# EAGLE design bga_test (EAGLE 6.4)

## Sheet 1 of 2
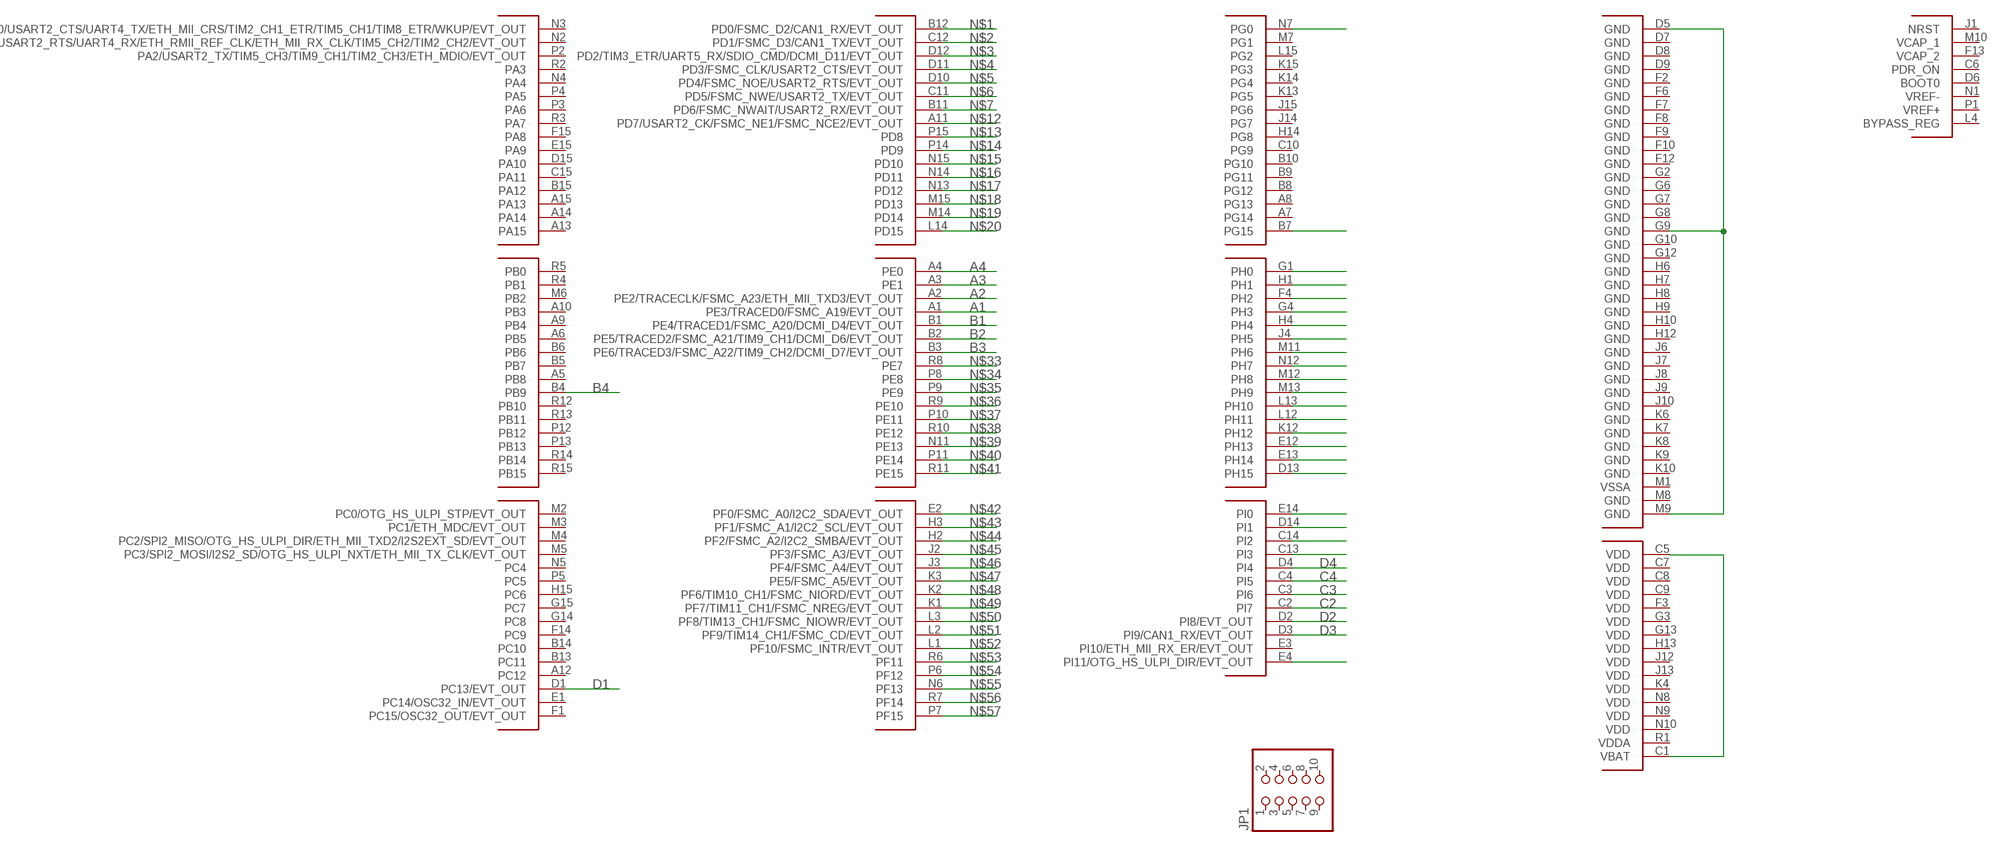
[diagram p0: schematic, sheet 1]

### Parts
JP1  PINHD-2X5  [2X05]
U$1  STM32_32BIT_MCU_STM32F407IG  [STM32_32BIT_MCU_UFBGA176+25]

### Nets
A1: U$1.A1(PE3/TRACED0/FSMC_A19/EVT_OUT) ; also sheet 2
A2: U$1.A2(PE2/TRACECLK/FSMC_A23/ETH_MII_TXD3/EVT_OUT) ; also sheet 2
A3: U$1.A3(PE1) ; also sheet 2
A4: U$1.A4(PE0) ; also sheet 2
B1: U$1.B1(PE4/TRACED1/FSMC_A20/DCMI_D4/EVT_OUT) ; also sheet 2
B2: U$1.B2(PE5/TRACED2/FSMC_A21/TIM9_CH1/DCMI_D6/EVT_OUT) ; also sheet 2
B3: U$1.B3(PE6/TRACED3/FSMC_A22/TIM9_CH2/DCMI_D7/EVT_OUT) ; also sheet 2
B4: U$1.B4(PB9) ; also sheet 2
C2: U$1.C2(PI7) ; also sheet 2
C3: U$1.C3(PI6) ; also sheet 2
C4: U$1.C4(PI5) ; also sheet 2
D1: U$1.D1(PC13/EVT_OUT)
D2: U$1.D2(PI8/EVT_OUT) ; also sheet 2
D3: U$1.D3(PI9/CAN1_RX/EVT_OUT) ; also sheet 2
D4: U$1.D4(PI4) ; also sheet 2
N$1: U$1.B12(PD0/FSMC_D2/CAN1_RX/EVT_OUT)
N$2: U$1.C12(PD1/FSMC_D3/CAN1_TX/EVT_OUT)
N$3: U$1.D12(PD2/TIM3_ETR/UART5_RX/SDIO_CMD/DCMI_D11/EVT_OUT)
N$4: U$1.D11(PD3/FSMC_CLK/USART2_CTS/EVT_OUT)
N$5: U$1.D10(PD4/FSMC_NOE/USART2_RTS/EVT_OUT)
N$6: U$1.C11(PD5/FSMC_NWE/USART2_TX/EVT_OUT)
N$7: U$1.B11(PD6/FSMC_NWAIT/USART2_RX/EVT_OUT)
N$12: U$1.A11(PD7/USART2_CK/FSMC_NE1/FSMC_NCE2/EVT_OUT)
N$13: U$1.P15(PD8)
N$14: U$1.P14(PD9)
N$15: U$1.N15(PD10)
N$16: U$1.N14(PD11)
N$17: U$1.N13(PD12)
N$18: U$1.M15(PD13)
N$19: U$1.M14(PD14)
N$20: U$1.L14(PD15)
N$33: U$1.R8(PE7)
N$34: U$1.P8(PE8)
N$35: U$1.P9(PE9)
N$36: U$1.R9(PE10)
N$37: U$1.P10(PE11)
N$38: U$1.R10(PE12)
N$39: U$1.N11(PE13)
N$40: U$1.P11(PE14)
N$41: U$1.R11(PE15)
N$42: U$1.E2(PF0/FSMC_A0/I2C2_SDA/EVT_OUT)
N$43: U$1.H3(PF1/FSMC_A1/I2C2_SCL/EVT_OUT)
N$44: U$1.H2(PF2/FSMC_A2/I2C2_SMBA/EVT_OUT)
N$45: U$1.J2(PF3/FSMC_A3/EVT_OUT)
N$46: U$1.J3(PF4/FSMC_A4/EVT_OUT)
N$47: U$1.K3(PE5/FSMC_A5/EVT_OUT)
N$48: U$1.K2(PF6/TIM10_CH1/FSMC_NIORD/EVT_OUT)
N$49: U$1.K1(PF7/TIM11_CH1/FSMC_NREG/EVT_OUT)
N$50: U$1.L3(PF8/TIM13_CH1/FSMC_NIOWR/EVT_OUT)
N$51: U$1.L2(PF9/TIM14_CH1/FSMC_CD/EVT_OUT)
N$52: U$1.L1(PF10/FSMC_INTR/EVT_OUT)
N$53: U$1.R6(PF11)
N$54: U$1.P6(PF12)
N$55: U$1.N6(PF13)
N$56: U$1.R7(PF14)
N$57: U$1.P7(PF15)
N$59: U$1.G1(PH0)
N$60: U$1.N7(PG0)
N$61: U$1.D5(GND) U$1.G9(GND) U$1.M9(GND)
N$64: U$1.C1(VBAT) U$1.C5(VDD)
N$65: U$1.D13(PH15)
N$66: U$1.M12(PH8)
N$67: U$1.B7(PG15)
N$68: U$1.E4(PI11/OTG_HS_ULPI_DIR/EVT_OUT)
N$69: U$1.E14(PI0)
N$70: U$1.D14(PI1)
N$71: U$1.C14(PI2)
N$72: U$1.C13(PI3)
N$76: U$1.E13(PH14)
N$77: U$1.E12(PH13)
N$78: U$1.K12(PH12)
N$79: U$1.L12(PH11)
N$80: U$1.L13(PH10)
N$81: U$1.M13(PH9)
N$82: U$1.N12(PH7)
N$83: U$1.M11(PH6)
N$84: U$1.J4(PH5)
N$85: U$1.H4
N$86: U$1.G4(PH3)
N$87: U$1.F4(PH2)
N$88: U$1.H1
Unconnected: JP1.1 JP1.2 JP1.3 JP1.4 JP1.5 JP1.6 JP1.7 JP1.8 JP1.9 JP1.10 U$1.A5(PB8) U$1.A6(PB5) U$1.A7(PG14) U$1.A8(PG13) U$1.A9(PB4) U$1.A10(PB3) U$1.A12(PC12) U$1.A13(PA15) U$1.A14 U$1.A15(PA13) U$1.B5(PB7) U$1.B6 U$1.B8(PG12) U$1.B9(PG11) U$1.B10(PG10) U$1.B13(PC11) U$1.B14(PC10) U$1.B15(PA12) U$1.C6(PDR_ON) U$1.C7(VDD) U$1.C8(VDD) U$1.C9(VDD) U$1.C10(PG9) U$1.C15(PA11) U$1.D6(BOOT0) U$1.D7(GND) U$1.D8(GND) U$1.D9(GND) U$1.D15(PA10) U$1.E1(PC14/OSC32_IN/EVT_OUT) U$1.E3(PI10/ETH_MII_RX_ER/EVT_OUT) U$1.E15(PA9) U$1.F1(PC15/OSC32_OUT/EVT_OUT) U$1.F2(GND) U$1.F3(VDD) U$1.F6(GND) U$1.F7(GND) U$1.F8(GND) U$1.F9(GND) U$1.F10(GND) U$1.F12(GND) U$1.F13(VCAP_2) U$1.F14(PC9) U$1.F15(PA8) U$1.G2(GND) U$1.G3(VDD) U$1.G6(GND) U$1.G7(GND) U$1.G8(GND) U$1.G10(GND) U$1.G12(GND) U$1.G13(VDD) U$1.G14(PC8) U$1.G15(PC7) U$1.H6(GND) U$1.H7(GND) U$1.H8(GND) U$1.H9(GND) U$1.H10(GND) U$1.H12(GND) U$1.H13(VDD) U$1.H14(PG8) U$1.H15(PC6) U$1.J1(NRST) U$1.J6(GND) U$1.J7(GND) U$1.J8(GND) U$1.J9(GND) U$1.J10(GND) U$1.J12(VDD) U$1.J13(VDD) U$1.J14(PG7) U$1.J15(PG6) U$1.K4(VDD) U$1.K6(GND) U$1.K7(GND) U$1.K8(GND) U$1.K9(GND) U$1.K10(GND) U$1.K13(PG5) U$1.K14(PG4) U$1.K15(PG3) U$1.L4(BYPASS_REG) U$1.L15(PG2) U$1.M1(VSSA) U$1.M2(PC0/OTG_HS_ULPI_STP/EVT_OUT) U$1.M3(PC1/ETH_MDC/EVT_OUT) U$1.M4(PC2/SPI2_MISO/OTG_HS_ULPI_DIR/ETH_MII_TXD2/I2S2EXT_SD/EVT_OUT) U$1.M5(PC3/SPI2_MOSI/I2S2_SD/OTG_HS_ULPI_NXT/ETH_MII_TX_CLK/EVT_OUT) U$1.M6(PB2) U$1.M7(PG1) U$1.M8(GND) U$1.M10(VCAP_1) U$1.N1(VREF-) U$1.N2(PA1/USART2_RTS/UART4_RX/ETH_RMII_REF_CLK/ETH_MII_RX_CLK/TIM5_CH2/TIM2_CH2/EVT_OUT) U$1.N3(PA0/USART2_CTS/UART4_TX/ETH_MII_CRS/TIM2_CH1_ETR/TIM5_CH1/TIM8_ETR/WKUP/EVT_OUT) U$1.N4(PA4) U$1.N5(PC4) U$1.N8(VDD) U$1.N9(VDD) U$1.N10(VDD) U$1.P1(VREF+) U$1.P2(PA2/USART2_TX/TIM5_CH3/TIM9_CH1/TIM2_CH3/ETH_MDIO/EVT_OUT) U$1.P3(PA6) U$1.P4(PA5) U$1.P5(PC5) U$1.P12(PB12) U$1.P13(PB13) U$1.R1(VDDA) U$1.R2(PA3) U$1.R3(PA7) U$1.R4(PB1) U$1.R5(PB0) U$1.R12(PB10) U$1.R13(PB11) U$1.R14(PB14) U$1.R15(PB15)

## Sheet 2 of 2
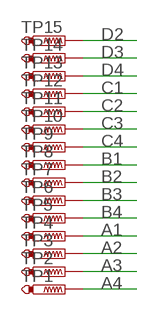
[diagram p1: schematic, sheet 2]

### Parts
TP1  PTR1TP06R  [TP06R]
TP2  PTR1TP06R  [TP06R]
TP3  PTR1TP06R  [TP06R]
TP4  PTR1TP06R  [TP06R]
TP5  PTR1TP06R  [TP06R]
TP6  PTR1TP06R  [TP06R]
TP7  PTR1TP06R  [TP06R]
TP8  PTR1TP06R  [TP06R]
TP9  PTR1TP06R  [TP06R]
TP10  PTR1TP06R  [TP06R]
TP11  PTR1TP06R  [TP06R]
TP12  PTR1TP06R  [TP06R]
TP13  PTR1TP06R  [TP06R]
TP14  PTR1TP06R  [TP06R]
TP15  PTR1TP06R  [TP06R]

### Nets
A1: TP4.TP ; also sheet 1
A2: TP3.TP ; also sheet 1
A3: TP2.TP ; also sheet 1
A4: TP1.TP ; also sheet 1
B1: TP8.TP ; also sheet 1
B2: TP7.TP ; also sheet 1
B3: TP6.TP ; also sheet 1
B4: TP5.TP ; also sheet 1
C1: TP12.TP
C2: TP11.TP ; also sheet 1
C3: TP10.TP ; also sheet 1
C4: TP9.TP ; also sheet 1
D2: TP15.TP ; also sheet 1
D3: TP14.TP ; also sheet 1
D4: TP13.TP ; also sheet 1

## Library data of the parts
JP1 = pinhead:PINHD-2X5: PIN HEADER
TP1-TP15 = testpad:PTR1: TEST PIN
U$1 = logic:STM32_32BIT_MCU_STM32F407IG

## Board
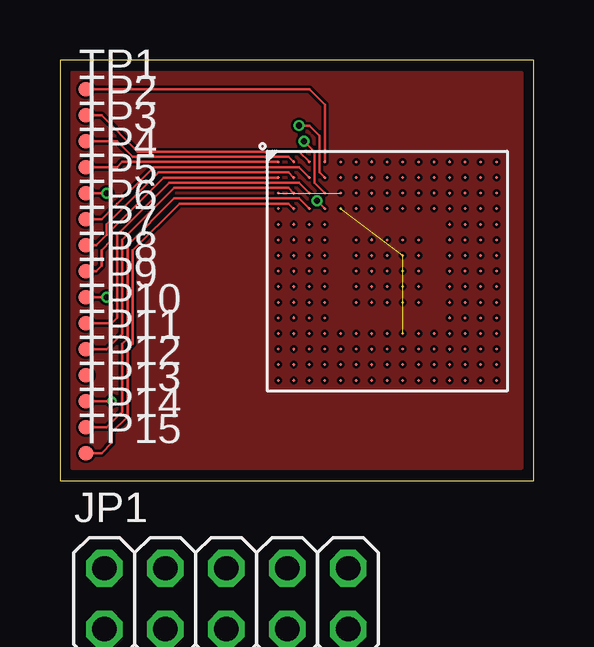
[diagram p2: board, top side]
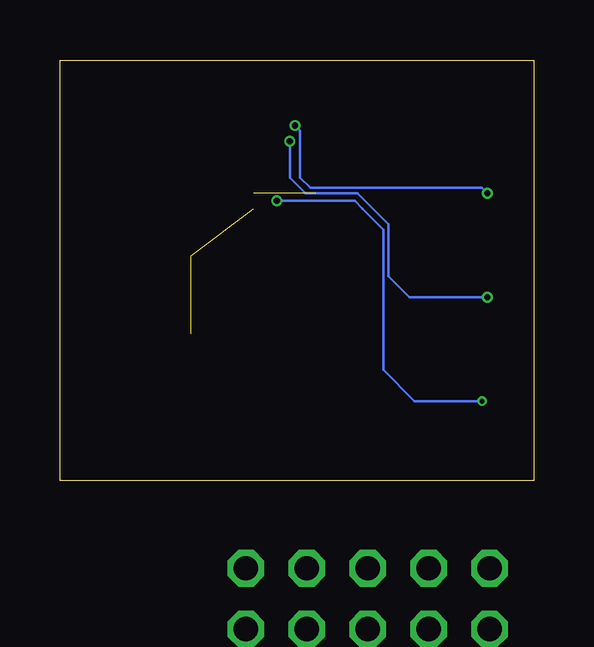
[diagram p3: board, bottom side, seen from below]

Size 19.77 x 17.53 mm. Coordinates in mm from the lower left corner, seen from the top.
Outline: 0,0 19.77,0 19.77,17.53 0,17.53 0,0
Copper layers (1*2*3*16): Top 0.035mm / dielectric 1.5mm / Route2 0.035mm / dielectric 0.15mm / Route3 0.035mm / dielectric 0.2mm / Bottom 0.035mm
Design rules "default *": minimum track width 4mil, minimum drill 10mil, track to track 4mil, track to pad 4mil, pad to pad 4mil, via to via 4mil, smd to smd 4mil, copper to edge 16mil, drill to drill 4mil, minimum pad ring 4mil, minimum via ring 4mil, stop-mask expansion 4mil, vias tented up to drill 16mil, thermal gap 10mil

### Footprints (pad centres in the part's own frame; a part is rotated, then mirrored left to right if it is on the bottom)
2X05 = drill 1.016 octagon: 1 -5.08,-1.27; 2 -5.08,1.27; 3 -2.54,-1.27; 4 -2.54,1.27; 5 0,-1.27; 6 0,1.27; 7 2.54,-1.27; 8 2.54,1.27; 9 5.08,-1.27; 10 5.08,1.27
TP06R = smd 0.6 x 0.6: TP 0,0
STM32_32BIT_MCU_UFBGA176+25 = smd 0.13 x 0.13: A1 -4.55,4.55; A2 -3.9,4.55; A3 -3.25,4.55; A4 -2.6,4.55; A5 -1.95,4.55; A6 -1.3,4.55; A7 -0.65,4.55; A8 0,4.55; A9 0.65,4.55; A10 1.3,4.55; A11 1.95,4.55; A12 2.6,4.55; A13 3.25,4.55; A14 3.9,4.55; A15 4.55,4.55; B1 -4.55,3.9; B2 -3.9,3.9; B3 -3.25,3.9; B4 -2.6,3.9; B5 -1.95,3.9; B6 -1.3,3.9; B7 -0.65,3.9; B8 0,3.9; B9 0.65,3.9; B10 1.3,3.9; B11 1.95,3.9; B12 2.6,3.9; B13 3.25,3.9; B14 3.9,3.9; B15 4.55,3.9; C1 -4.55,3.25; C2 -3.9,3.25; C3 -3.25,3.25; C4 -2.6,3.25; C5 -1.95,3.25; C6 -1.3,3.25; C7 -0.65,3.25; C8 0,3.25; C9 0.65,3.25; C10 1.3,3.25; C11 1.95,3.25; C12 2.6,3.25; C13 3.25,3.25; C14 3.9,3.25; C15 4.55,3.25; D1 -4.55,2.6; D2 -3.9,2.6; D3 -3.25,2.6; D4 -2.6,2.6; D5 -1.95,2.6; D6 -1.3,2.6; D7 -0.65,2.6; D8 0,2.6; D9 0.65,2.6; D10 1.3,2.6; D11 1.95,2.6; D12 2.6,2.6; D13 3.25,2.6; D14 3.9,2.6; D15 4.55,2.6; E1 -4.55,1.95; E2 -3.9,1.95; E3 -3.25,1.95; E4 -2.6,1.95; E12 2.6,1.95; E13 3.25,1.95; E14 3.9,1.95; E15 4.55,1.95; F1 -4.55,1.3; F2 -3.9,1.3; F3 -3.25,1.3; F4 -2.6,1.3; F6 -1.3,1.3; F7 -0.65,1.3; F8 0,1.3; F9 0.65,1.3; F10 1.3,1.3; F12 2.6,1.3; F13 3.25,1.3; F14 3.9,1.3; F15 4.55,1.3; G1 -4.55,0.65; G2 -3.9,0.65; G3 -3.25,0.65; G4 -2.6,0.65; G6 -1.3,0.65; G7 -0.65,0.65; G8 0,0.65; G9 0.65,0.65; G10 1.3,0.65; G12 2.6,0.65; G13 3.25,0.65; G14 3.9,0.65; G15 4.55,0.65; H1 -4.55,0; H2 -3.9,0; H3 -3.25,0; H4 -2.6,0; H6 -1.3,0; H7 -0.65,0; H8 0,0; H9 0.65,0; H10 1.3,0; H12 2.6,0; H13 3.25,0; H14 3.9,0; H15 4.55,0; J1 -4.55,-0.65; J2 -3.9,-0.65; J3 -3.25,-0.65; J4 -2.6,-0.65; J6 -1.3,-0.65; J7 -0.65,-0.65; J8 0,-0.65; J9 0.65,-0.65; J10 1.3,-0.65; J12 2.6,-0.65; J13 3.25,-0.65; J14 3.9,-0.65; J15 4.55,-0.65; K1 -4.55,-1.3; K2 -3.9,-1.3; K3 -3.25,-1.3; K4 -2.6,-1.3; K6 -1.3,-1.3; K7 -0.65,-1.3; K8 0,-1.3; K9 0.65,-1.3; K10 1.3,-1.3; K12 2.6,-1.3; K13 3.25,-1.3; K14 3.9,-1.3; K15 4.55,-1.3; L1 -4.55,-1.95; L2 -3.9,-1.95; L3 -3.25,-1.95; L4 -2.6,-1.95; L12 2.6,-1.95; L13 3.25,-1.95; L14 3.9,-1.95; L15 4.55,-1.95; M1 -4.55,-2.6; M2 -3.9,-2.6; M3 -3.25,-2.6; M4 -2.6,-2.6; M5 -1.95,-2.6; M6 -1.3,-2.6; M7 -0.65,-2.6; M8 0,-2.6; M9 0.65,-2.6; M10 1.3,-2.6; M11 1.95,-2.6; M12 2.6,-2.6; M13 3.25,-2.6; M14 3.9,-2.6; M15 4.55,-2.6; N1 -4.55,-3.25; N2 -3.9,-3.25; N3 -3.25,-3.25; N4 -2.6,-3.25; N5 -1.95,-3.25; N6 -1.3,-3.25; N7 -0.65,-3.25; N8 0,-3.25; N9 0.65,-3.25; N10 1.3,-3.25; N11 1.95,-3.25; N12 2.6,-3.25; N13 3.25,-3.25; N14 3.9,-3.25; N15 4.55,-3.25; P1 -4.55,-3.9; P2 -3.9,-3.9; P3 -3.25,-3.9; P4 -2.6,-3.9; P5 -1.95,-3.9; P6 -1.3,-3.9; P7 -0.65,-3.9; P8 0,-3.9; P9 0.65,-3.9; P10 1.3,-3.9; P11 1.95,-3.9; P12 2.6,-3.9; P13 3.25,-3.9; P14 3.9,-3.9; P15 4.55,-3.9; R1 -4.55,-4.55; R2 -3.9,-4.55; R3 -3.25,-4.55; R4 -2.6,-4.55; R5 -1.95,-4.55; R6 -1.3,-4.55; R7 -0.65,-4.55; R8 0,-4.55; R9 0.65,-4.55; R10 1.3,-4.55; R11 1.95,-4.55; R12 2.6,-4.55; R13 3.25,-4.55; R14 3.9,-4.55; R15 4.55,-4.55

### Placement (x,y rotation side)
JP1  6.93,-4.91 0 top  (outside the outline)
TP1  1.08,16.32 0 top
TP2  1.08,15.24 0 top
TP3  1.08,14.15 0 top
TP4  1.08,13.07 0 top
TP5  1.08,11.99 0 top
TP6  1.08,10.9 0 top
TP7  1.08,9.82 0 top
TP8  1.08,8.74 0 top
TP9  1.08,7.65 0 top
TP10  1.08,6.57 0 top
TP11  1.08,5.49 0 top
TP12  1.08,4.4 0 top
TP13  1.08,3.32 0 top
TP14  1.08,2.24 0 top
TP15  1.08,1.15 0 top
U$1  13.65,8.74 0 top

### Tracks (layer width: path | path; a pad name or v marks a point on that pad's centre or on a via)
A1
  Top 0.102: U$1.A1 2.6,13.29 2.38,13.07 TP4.TP
A2
  Top 0.102: U$1.A2 | U$1.A2 9.53,13.5 3.03,13.5 2.38,14.15 TP3.TP | TP3.TP
A3
  Top 0.102: U$1.A3 | U$1.A3 9.97,13.72 3.25,13.72 1.73,15.24 TP2.TP
A4
  Top 0.102: U$1.A4 11.05,15.67 10.4,16.32 TP1.TP
B1
  Top 0.102: U$1.B1 4.33,12.64 2.17,10.47 2.17,10.04 1.73,9.6 1.73,8.95 1.52,8.74 TP8.TP
B2
  Top 0.102: U$1.B2 | U$1.B2 9.53,12.85 4.12,12.85 1.95,10.69 1.95,10.25 1.52,9.82 TP7.TP
B3
  Top 0.102: U$1.B3 | U$1.B3 9.97,13.07 3.9,13.07 2.38,11.55 | TP6.TP 1.73,10.9 2.38,11.55 | TP6.TP | 2.38,11.55
B4  (via drill 0.25 pad 0.46)
  Top 0.102: U$1.B4 | U$1.B4 10.83,12.85 10.83,14.37 10.4,14.8 v9.97,14.8 | v1.95,11.99 TP5.TP
  Bottom 0.102: v1.95,11.99 | v1.95,11.99 2.17,12.2 9.32,12.2 9.75,12.64 9.75,14.59 v9.97,14.8
C2
  Top 0.102: U$1.C2 | U$1.C2 9.53,12.2 4.77,12.2 2.6,10.04 2.6,6.14 1.95,5.49 TP11.TP
C3
  Top 0.102: U$1.C3 | U$1.C3 9.97,12.42 4.55,12.42 2.38,10.25 2.38,6.79 2.17,6.57 | 2.17,6.57 TP10.TP | TP10.TP | 2.17,6.57
C4  (via drill 0.25 pad 0.46)
  Top 0.102: U$1.C4 | U$1.C4 10.62,12.42 10.62,13.72 v10.18,14.15 | v1.95,7.65 TP9.TP
  Bottom 0.102: v1.95,7.65 5.2,7.65 6.07,8.52 6.07,10.69 7.37,11.99 9.53,11.99 10.18,12.64 v10.18,14.15
D2
  Top 0.102: U$1.D2 | U$1.D2 9.53,11.55 4.98,11.55 3.03,9.6 3.03,5.7 2.82,5.49 2.82,2.67 2.17,2.02 2.17,1.59 1.73,1.15 TP15.TP
D3
  Top 0.102: U$1.D3 | U$1.D3 9.97,11.77 4.77,11.77 2.82,9.82 2.82,5.92 2.6,5.7 2.6,2.89 1.95,2.24 TP14.TP | TP14.TP
D4  (via drill 0.2, 0.25 pad 0.46)
  Top 0.102: TP13.TP v2.17,3.32 | U$1.D4 | U$1.D4 v10.72,11.66
  Bottom 0.102: v2.17,3.32 4.98,3.32 6.28,4.62 6.28,10.47 7.15,11.34 | 7.15,11.34 | 7.15,11.34 7.47,11.66 v10.72,11.66
GND
  pour Top: 0.51,17.02 19.26,17.02 19.26,0.51 0.51,0.51
N$61  (2 unrouted)
N$64  (1 unrouted)